# Altium project OMODRI.PrjPcb (part 5 of 5)

## Sheet OMODRI_Support.SchDoc
size A3; Date: Not shown in title block; ApprovedBy: Not shown in title block; CheckedBy: Not shown in title block; Author: Not shown in title block; CompanyName: Not shown in title block; DrawnBy: Cody Watkins; Engineer: Not shown in title block; Organization: Not shown in title block; Address1: Not shown in title block; Address2: Not shown in title block; Address3: Not shown in title block; Address4: Not shown in title block; DocumentNumber: 3; Revision: Use project parameter SCH_Rev; SheetNumber: 3; SheetTotal: 11; PageSetup: Record=PageOptions|CenterHorizontal=True|CenterVertical=True|PrintScale=1.00|XCorrection=1.00|YCorrection=1.00|PrintKind=0|BorderSize=5000000|LeftOffset=0|BottomOffset=0|Orientation=2|PaperLength=1000|PaperWidth=1000|Scale=100|PaperSource=15|PrintQuality=600|MediaType=1|DitherType=10|PaperKind=Letter|PrintScaleMode=1; CurrentTime: Not shown in title block; CurrentDate: Not shown in title block; Time: Not shown in title block; DocumentFullPathAndName: Not shown in title block; DocumentName: Not shown in title block; ModifiedDate: Not shown in title block; ImagePath: Not shown in title block
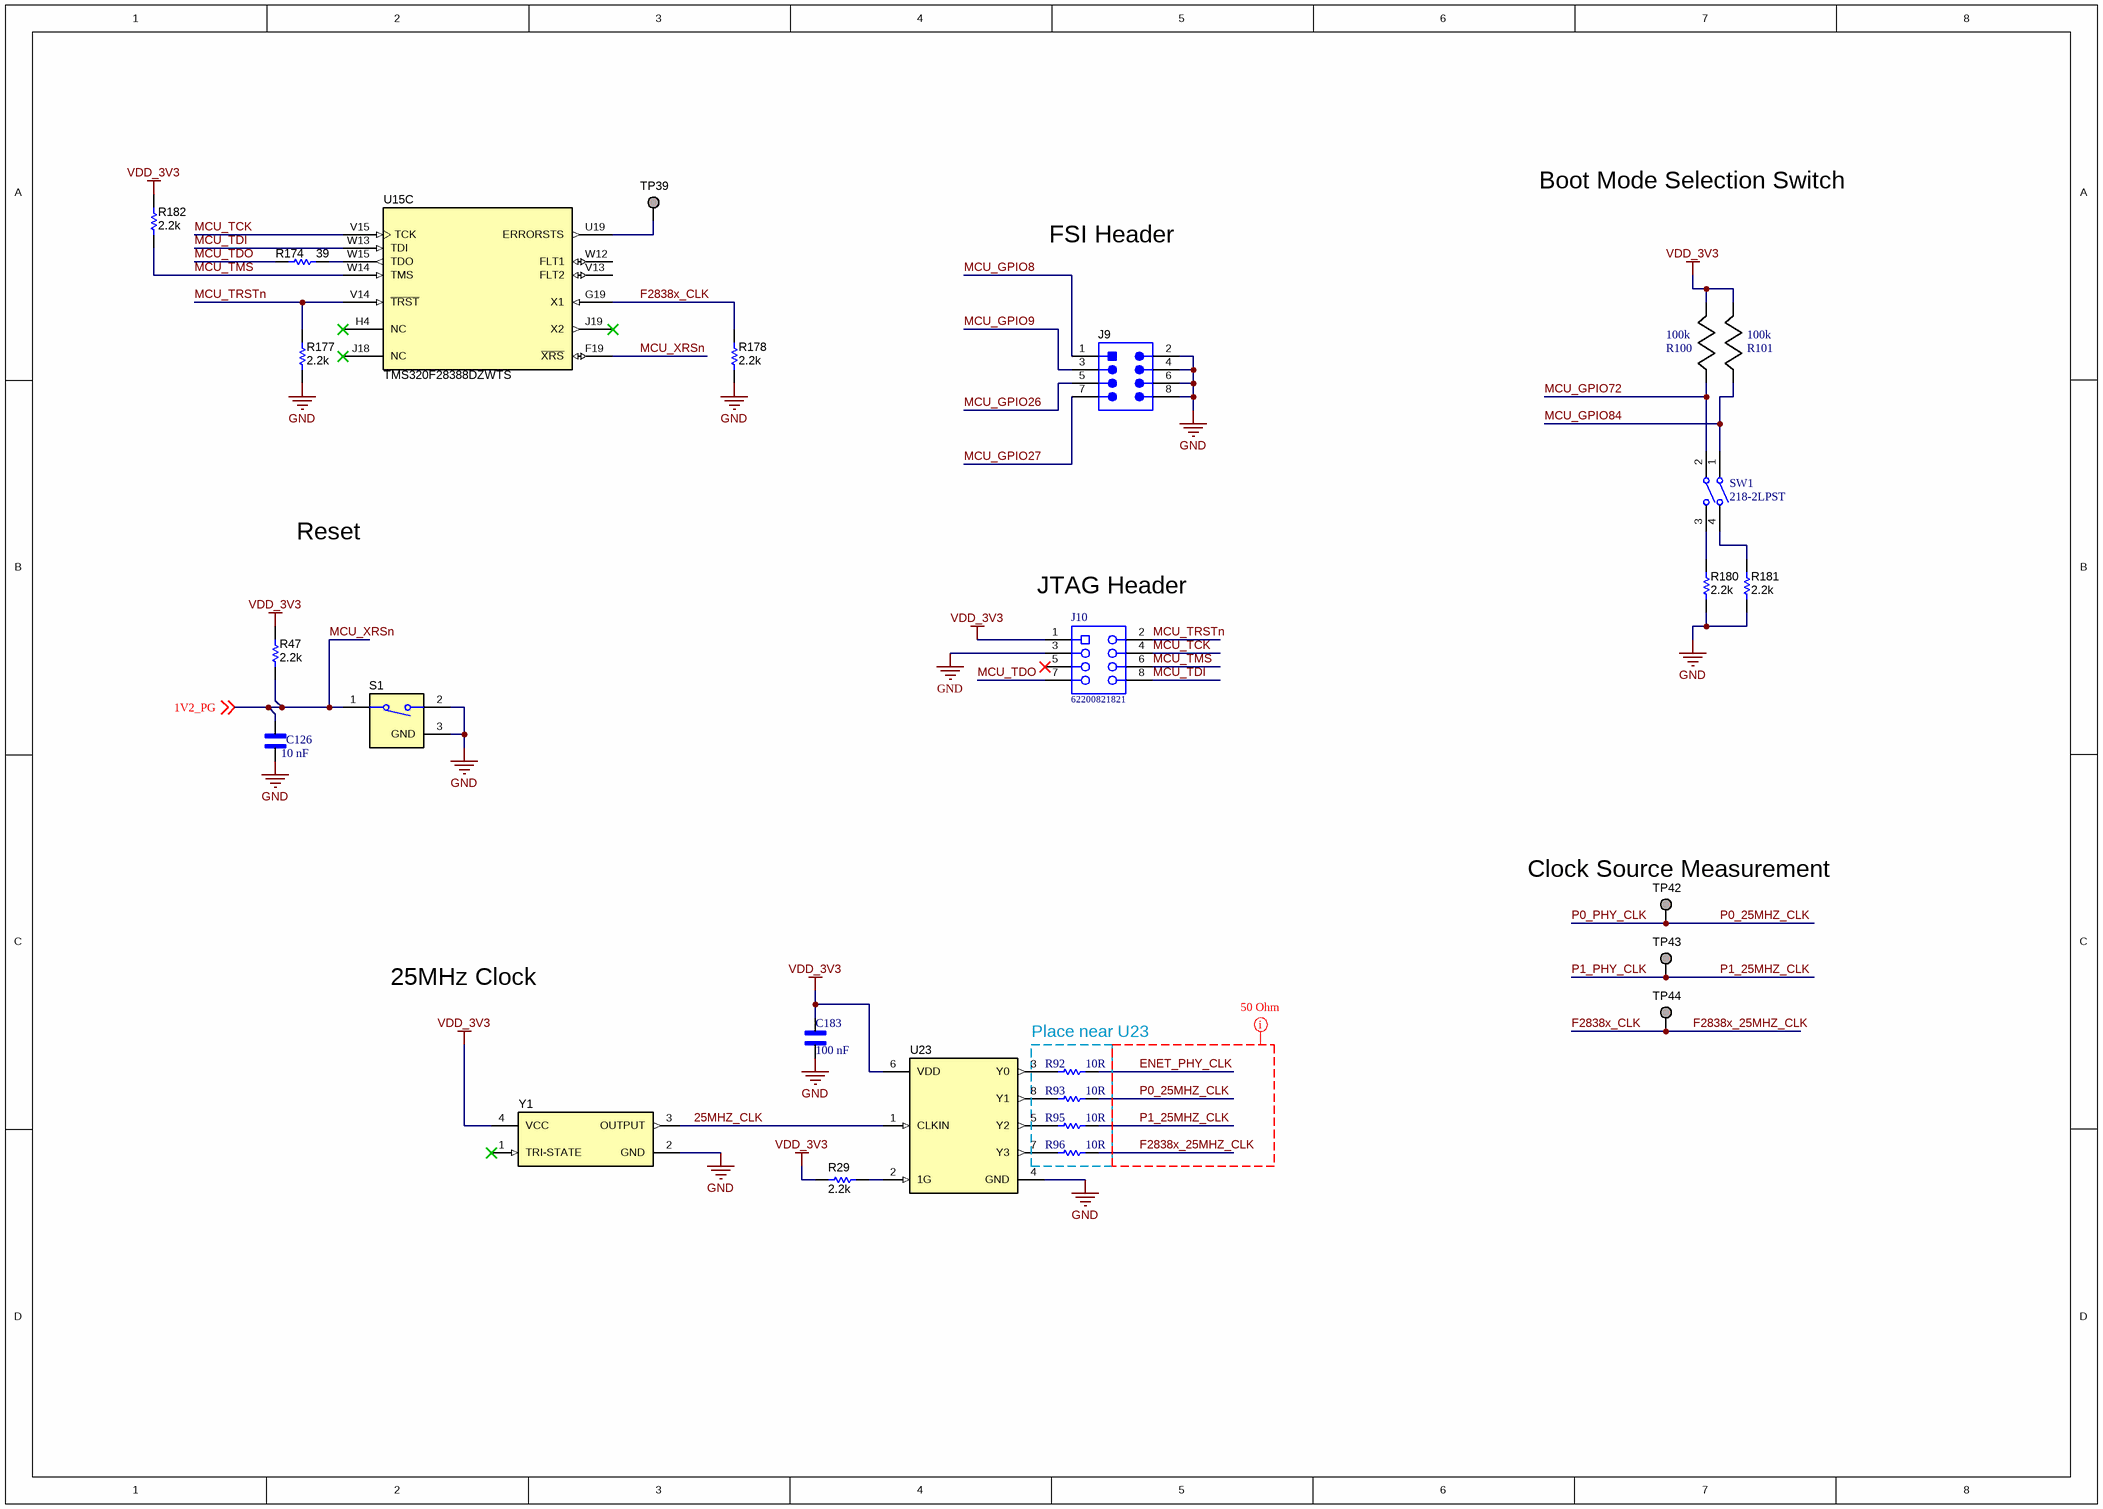
[diagram p8: OMODRI_Support.SchDoc]

### Parts
C126  value 10 nF  [CAPC0603X33N]  (hidden comment: GRM033R71E103KE14D)
C183  value 100 nF  [CAPC0603X33N]  (hidden comment: GRM033R61E104KE14D)
J9  TMM-104-01-T-D  [Samtec_TMM-104-01-x-D]  (value not drawn)
J10  62200821821  [62200821821]
R29  ValueDisplayed: 2.2k  [0402]  (hidden comment: CRCW04022K20JNED)
R47  ValueDisplayed: 2.2k  [0402]  (hidden comment: CRCW04022K20JNED)
R92  Resistance: 10R  [RESC1005X40X25ML05T10]  (hidden comment: CRCW040210R0FKEDHP)
R93  Resistance: 10R  [RESC1005X40X25ML05T10]  (hidden comment: CRCW040210R0FKEDHP)
R95  Resistance: 10R  [RESC1005X40X25ML05T10]  (hidden comment: CRCW040210R0FKEDHP)
R96  Resistance: 10R  [RESC1005X40X25ML05T10]  (hidden comment: CRCW040210R0FKEDHP)
R100  Resistance: 100k  [0402]  (hidden comment: CRCW0402100KFKED)
R101  Resistance: 100k  [0402]  (hidden comment: CRCW0402100KFKED)
R174  ValueDisplayed: 39  [0402]  (hidden comment: CRCW040239R0JNED)
R177  ValueDisplayed: 2.2k  [0402]  (hidden comment: CRCW04022K20JNED)
R178  ValueDisplayed: 2.2k  [0402]  (hidden comment: CRCW04022K20JNED)
R180  ValueDisplayed: 2.2k  [0402]  (hidden comment: CRCW04022K20JNED)
R181  ValueDisplayed: 2.2k  [0402]  (hidden comment: CRCW04022K20JNED)
R182  ValueDisplayed: 2.2k  [0402]  (hidden comment: CRCW04022K20JNED)
S1  B3U-1100P  [SW_B3U-1100P]  (value not drawn)
SW1  218-2LPST  [CTS-218-2LPST_V]
TP39  TESTPOINT  [TP_50MIL-25MILHOLE]  (value not drawn)  (no BOM)
TP42  TESTPOINT  [TP_50MIL-25MILHOLE]  (value not drawn)  (no BOM)
TP43  TESTPOINT  [TP_50MIL-25MILHOLE]  (value not drawn)  (no BOM)
TP44  TESTPOINT  [TP_50MIL-25MILHOLE]  (value not drawn)  (no BOM)
U15  TMS320F28388DZWTS  [ZWT0337A]  (part C of 5)
U23  CDCLVC1104PW  [PW0008A_N]  (value not drawn)
Y1  ECS-2520S33-250-FN-TR  [ECS_ECS-2520S]  (value not drawn)

### Nets
GND: C126.1 C183.2 J9.2 J9.4 J9.6 J9.8 J10.3 R177.1 R178.1 R180.2 R181.1 S1.2 S1.3(GND) U23.4(GND) Y1.2(GND)
VDD_3V3: C183.1 J10.1 R29.2 R47.2 R100.1 R101.1 R182.2 U23.6(VDD) Y1.4(VCC)
25MHZ_CLK: U23.1(CLKIN) Y1.3(OUTPUT)
ENET_PHY_CLK: R92.2
F2838x_25MHZ_CLK: R96.2 R178.2 TP44.1 U15.G19(X1)  [also labelled F2838x_CLK]
MCU_GPIO8: J9.1
MCU_GPIO9: J9.3
MCU_GPIO26: J9.5
MCU_GPIO27: J9.7
MCU_GPIO72: R100.2 SW1.2
MCU_GPIO84: R101.2 SW1.1
MCU_TCK: J10.4 U15.V15(TCK)
MCU_TDI: J10.8 U15.W13(TDI)
MCU_TDO: J10.7 R174.1
MCU_TMS: J10.6 R182.1 U15.W14(TMS)
MCU_TRSTn: J10.2 R177.2 U15.V14(~{TRST})
MCU_XRSn: C126.2 R47.1 S1.1 U15.F19(~{XRS}) ; off-sheet 1V2_PG  [also labelled 1V2_PG]
P0_25MHZ_CLK: R93.2 TP42.1  [also labelled P0_PHY_CLK]
P1_25MHZ_CLK: R95.2 TP43.1  [also labelled P1_PHY_CLK]
NetR29_1: R29.1 U23.2(1G)
NetR92_1: R92.1 U23.3(Y0)
NetR93_1: R93.1 U23.8(Y1)
NetR95_1: R95.1 U23.5(Y2)
NetR96_1: R96.1 U23.7(Y3)
NetR174_2: R174.2 U15.W15(TDO)
NetR180_1: R180.1 SW1.3
NetR181_2: R181.2 SW1.4
NetTP39_1: TP39.1 U15.U19(ERRORSTS)

Not connected (* = marked no-connect by the designer): J10 5*; U15 H4(NC)* J18(NC)* J19(X2)* V13(FLT2) W12(FLT1); Y1 1(TRI-STATE)*

### Layout directives
50 Ohm Impedance: Undefined: ENET_PHY_CLK, F2838x_25MHZ_CLK, P0_25MHZ_CLK, P1_25MHZ_CLK

### Notes on the sheet
- Boot Mode Selection Switch
- FSI Header
- Reset
- (near J10) JTAG Header
- (near TP42) Clock Source Measurement
- 25MHz Clock
- Place near U23
- Drawn By:
- SVN Rev:
- Number:
- TID #:
- Orderable:
- Rev:
- Sheet Title:
- File:
- Project Title:
- Designed for:
- Assembly Variant:
- Mod. Date:
- Sheet:
- Size:
- of
- B
- http://www.ti.com
- Texas Instruments and/or its licensors do not warrant the accuracy or completeness of this specification or any information contained therein. Texas Instruments and/or its licensors do not warrant that this design will meet the specifications, will be suitable for your application or fit for any particular purpose, or will operate in an implementation. Texas Instruments and/or its licensors do not warrant that the design is production worthy. You should completely validate and test your design implementation to confirm the system functionality for your application.
- Engineer:
- Contact:
- © Texas Instruments

### Library data of the parts
C126 = GRM033R71E103KE14D: SMD Capacitor X7R_EIA_ with Capacitance: 10000pF Tol. 10%. Rated Voltage: 25Vdc; MF: Murata; SnapEDA_Link: https://www.snapeda.com/parts/GRM033R71E103KE14D/Murata/view-part/4379447/?ref=snap; Package: 0603 Taiyo Yuden; MP: GRM033R71E103KE14D; Digi-Key_Purchase_URL: https://www.digikey.com/product-detail/en/murata-electronics/GRM033R71E103KE14D/490-14454-1-ND/6606915?utm_source=snapeda&utm_medium=aggregator&utm_campaign=symbol; Digi-Key_Part_Number: 490-14454-1-ND
C183 = GRM033R61E104KE14D: as C114-C116 on sheet OMODRI_EtherCAT_1; SnapEDA_Link: https://www.snapeda.com/parts/GRM033R61E104KE14D/Murata/view-part/4375622/?ref=snap; Availability: Unavailable; MP: GRM033R61E104KE14D; Package: 0603 Taiyo Yuden; Price: None
J9 = CMP-0055568-2: Header, 2mm, 4x2, Tin, TH; Manufacturer: Samtec; Current_A: 3.2A; Shrouded: N; Gender: Male; Cert_CSA: Y; Row_Count: 2; ComponentLink1URL: http://suddendocs.samtec.com/catalog_english/tmm_th.pdf; ClassName: Header; Supplier Part Number 2: 12P0661; Supplier 2: Newark; Supplier Part Number 3: 1803386; Color: Black; Supplier 3: Farnell; RoHS: Y; MountType: TH; Supplier 1: Digi-Key; PackageReference: Header, 2mm, 4x2, TH; PinCount: 8; CompType: Header; PartNumber: TMM-104-01-T-D; Orientation: Vertical; RowSpacing_mm: 2; ComponentLink1Description: Datasheet URL; Supplier Part Number 1: SAM1177-04-ND; Pitch_mm: 2; ContactFinish: Tin; Cert_UL: Y
J10 = CMP-1502-01180-1: THT Vertical Socket Header WR-PHD, Pitch 1.27 mm, Dual Row, 8 pins; Manufacturer: Wurth Elektronik; Withstanding Voltage: 500VAC; Working Voltage: 250VAC; Contact Resistance: 20mOhm; Gender: Female; Pitch: 1.27mm; Rated Current: 1A; Pin Number: 8; Part Number: 62200821821; Row Number: Dual; Package Reference: 62200821821; Mounting Technology: THT; Packaging: Tube; Manufacturer URL: http://www.we-online.de; Publisher: WurthElektronik; Orientation: Vertical; Operating Temperature: -40to105degC; Datasheet URL: https://katalog.we-online.de/em/datasheet/62200821821.pdf
R29 R47 R177 R178 R182 = CMP-0026890-5: as R4-R6 on sheet OMODRI_EtherCAT_1; Supplier Part Number 2: 59M6710; Supplier 2: Newark; Supplier Part Number 3: 71-CRCW0402J-2.2K-E3; Supplier 3: Mouser; RoHS: E; Value1: 5%; MountType: SMT; Supplier 1: Digi-Key; PackageReference: 0402; Tolerance_%: 5%; Res_ohm: 2.2k; SizeArea_mm2: 0.5; CompType: Resistor; PartNumber: CRCW04022K20JNED; ComponentLink1Description: Datasheet link; Supplier Part Number 1: 541-2.2KJCT-ND; Technology: Thick Film; ComponentLink1URL: http://www.vishay.com/docs/20035/dcrcwe3.pdf
R92 R93 R95 R96 = CRCW040210R0FKEDHP: SMD Chip Resistor, 0402 [1005 Metric], 10 ohm, CRCW-HP e3 Series, 50 V, Thick Film, 200 mW; Manufacturer: Vishay Dale; Voltage Rating (DC): 50V; Temperature Coefficient: 100ppm/°C; Tolerance: 1%; Power Rating: 125mW; Part Number: CRCW040210R0FKEDHP; Supplier 1: Digi-Key; Manufacturer Part Number: CRCW040210R0FKEDHP; RoHS: Yes; Category: Chip SMD Resistors; Stock 1: 25822; Pricing 1: 1=0,14000, 10=0,12600, 100=0,04840, 1000=0,02130, 2500=0,01839, 5000=0,01646 (USD); Mount: Surface Mount; Case/Package: 0402; Weight: 2.3E-05oz; Contact Plating: Tin; Case Code (Imperial): 0402; Case Code (Metric): 1005; Min Operating Temperature: -55°C; Max Operating Temperature: 155°C; Packaging: Tape and Reel; Voltage Rating: 50V; Package Quantity: 10000; Termination: SMD/SMT; Composition: Thick Film; Military Standard: Not; Length: 1mm; Height: 0.3mm; Width: 0.5mm; Depth: 0.5mm; Radiation Hardening: No; Lead Free: Lead Free; REACH SVHC: Unknown; ComponentLink1URL: https://datasheet.ciiva.com/5542/crcwhpe3-46056-5542142.pdf?src-supplier=Mouser; ComponentLink1Description: https://datasheet.ciiva.com/5542/crcwhpe3-46056-5542142.pdf?src-supplier=Mouser; Supplier Part Number 1: 541-10.0YCT-ND
R100 R101 = CRCW0402100KFKED: Res Thick Film 0402 100K Ohm 1% 1/16W 100ppm/C Molded SMD Paper T/R; Manufacturer: Vishay; Vendor: Vishay-Dale; Temperature Coefficient: 100ppm/°C; Power Rating: 63mW; Voltage Rating: 50V; Manufacturer_Part_Number: CRCW0402100KFKED; Manufacturer_Name: Vishay-Dale; RefDes: RefDes; TYPE: TYPE; Value: Value; Supplier 1: Farnell; Manufacturer Part Number: CRCW0402100KFKED; RoHS: Yes; Category: Chip SMD Resistors; Stock 1: 6820000; Pricing 1: 10000=0,00330 (EUR); Mount: Surface Mount; Case/Package: 0402; Number of Pins: 2; Weight: 2.3E-05oz; Contact Plating: Tin; Case Code (Metric): 1005; Case Code (Imperial): 0402; Min Operating Temperature: -55°C; Max Operating Temperature: 155°C; Tolerance: 1%; Composition: Thick Film; Termination: SMD/SMT; Number of Terminations: 2; Features: Automotive AEC-Q200; Max Power Dissipation: 63mW; Packaging: Tape and Reel; Package Quantity: 10000; Voltage Rating (DC): 50V; Military Standard: Not; Length: 1mm; Height: 0.35mm; Depth: 0.5mm; Width: 0.02inch; Radiation Hardening: No; Lead Free: Lead Free; REACH SVHC: Unknown; ComponentLink1URL: https://datasheet.ciiva.com/11810/0900766b80d98824-11810752.pdf?src-supplier=RSComponents; ComponentLink1Description: https://datasheet.ciiva.com/11810/0900766b80d98824-11810752.pdf?src-supplier=RSComponents; ComponentLink2URL: https://datasheet.ciiva.com/2463/dcrcwe3-2463064.pdf?src-supplier=Digi-Key; ComponentLink2Description: https://datasheet.ciiva.com/2463/dcrcwe3-2463064.pdf?src-supplier=Digi-Key; ComponentLink3URL: https://datasheet.ciiva.com/2463/dcrcwe3-2463065.pdf?src-supplier=Digi-Key; ComponentLink3Description: https://datasheet.ciiva.com/2463/dcrcwe3-2463065.pdf?src-supplier=Digi-Key; ComponentLink4URL: https://datasheet.ciiva.com/2463/dcrcwe3-2463066.pdf?src-supplier=Digi-Key; ComponentLink4Description: https://datasheet.ciiva.com/2463/dcrcwe3-2463066.pdf?src-supplier=Digi-Key; ComponentLink5URL: https://datasheet.ciiva.com/3255/dcrcwe3-3255948.pdf?src-supplier=Avnet; ComponentLink5Description: https://datasheet.ciiva.com/3255/dcrcwe3-3255948.pdf?src-supplier=Avnet; ComponentLink6URL: https://datasheet.ciiva.com/5546/dcrcwe3-109170-5546638.pdf?src-supplier=Mouser; ComponentLink6Description: https://datasheet.ciiva.com/5546/dcrcwe3-109170-5546638.pdf?src-supplier=Mouser; ComponentLink7URL: https://datasheet.ciiva.com/26316/fld-crcw-e3-data-en-26316630.pdf?src-supplier=Distrelec; ComponentLink7Description: https://datasheet.ciiva.com/26316/fld-crcw-e3-data-en-26316630.pdf?src-supplier=Distrelec; ComponentLink8URL: https://datasheet.ciiva.com/16776/70201119-16776281.pdf?src-supplier=Allied+Electronics; ComponentLink8Description: https://datasheet.ciiva.com/16776/70201119-16776281.pdf?src-supplier=Allied+Electronics; ComponentLink9URL: https://datasheet.ciiva.com/16941/dcrcwe3-16941129.pdf?src-supplier=Avnet+Europe; ComponentLink9Description: https://datasheet.ciiva.com/16941/dcrcwe3-16941129.pdf?src-supplier=Avnet+Europe; ComponentLink10URL: https://datasheet.ciiva.com/3255/dcrcwe3-3255947.pdf?src-supplier=Avnet; ComponentLink10Description: https://datasheet.ciiva.com/3255/dcrcwe3-3255947.pdf?src-supplier=Avnet; ComponentLink11URL: https://datasheet.ciiva.com/16208/dcrcwe3-16208508.pdf?src-supplier=Future+Electronics; ComponentLink11Description: https://datasheet.ciiva.com/16208/dcrcwe3-16208508.pdf?src-supplier=Future+Electronics; ComponentLink12URL: https://datasheet.ciiva.com/46441/1720486-46441598.pdf?src-supplier=Element14; ComponentLink12Description: https://datasheet.ciiva.com/46441/1720486-46441598.pdf?src-supplier=Element14; Supplier Part Number 1: 2121857
R174 = CMP-0026916-3: RES, 39, 5%, 0.063 W, AEC-Q200 Grade 0, 0402; Manufacturer: Vishay-Dale; Power_W: 63mW; TempCo: 200 ppm/C; Value_Code: 39R0; Value: 39; EIA_Code: E24; SizeX_mm: 1; SizeY_mm: 0.5; SizeZ_mm: 0.6; Value2: 0.063W; AEC Qualified: Y; VDC_V: 50V; AEC Category: Q200; AEC Grade: 0; Supplier Part Number 2: 89M6649; Supplier 2: Newark; Supplier Part Number 3: 71-CRCW0402J-39-E3; Supplier 3: Mouser; RoHS: E; Value1: 5%; MountType: SMT; Supplier 1: Digi-Key; PackageReference: 0402; Tolerance_%: 5%; Res_ohm: 39; SizeArea_mm2: 0.5; CompType: Resistor; PartNumber: CRCW040239R0JNED; ComponentLink1Description: Datasheet link; Supplier Part Number 1: 541-39JCT-ND; Technology: Thick Film; ComponentLink1URL: http://www.vishay.com/docs/20035/dcrcwe3.pdf
R180 R181 = CMP-0026890-5: RES, 2.2 k, 5%, 0.063 W, AEC-Q200 Grade 0, 0402; Manufacturer: Vishay-Dale; Value: 2.2k; Value_Code: 2k20; Power_W: 63mW; Value2: 0.063W; VDC_V: 50V; TempCo: 200 ppm/C; EIA_Code: E24; AEC Category: Q200; AEC Qualified: Y; AEC Grade: 0; SizeArea_mm2: 0.5; SizeX_mm: 1; SizeZ_mm: 0.6; CompType: Resistor; PartNumber: CRCW04022K20JNED; PackageReference: 0402; RoHS: E; Res_ohm: 2.2k; Tolerance_%: 5%; Value1: 5%; MountType: SMT; Technology: Thick Film; ComponentLink1Description: Datasheet link; ComponentLink1URL: http://www.vishay.com/docs/20035/dcrcwe3.pdf; Supplier 1: Digi-Key; Supplier Part Number 1: 541-2.2KJCT-ND; Supplier 2: Newark; Supplier Part Number 2: 59M6710; Supplier 3: Mouser; Supplier Part Number 3: 71-CRCW0402J-2.2K-E3; SizeY_mm: 0.5
S1 = CMP-0002193-2: Switch, SPST-NO, Off-Mom, 12 V, SMD; Manufacturer: Omron Electronic Components; CurrentRating_mA: 50A; PositionCount: 1; VDC_V: 12V; Supplier 2: Newark; Supplier 3: Mouser; Supplier 1: Digi-Key; Supplier Part Number 1: SW1021CT-ND; Supplier Part Number 2: 39M4619; Supplier Part Number 3: 653-B3U-1100P; PartNumber: B3U-1100P; ComponentLink1Description: Datasheet URL; LatestRevisionDate: 2017-03-09; CompType: Switch; Publisher: Texas Instruments; Circuit: SPST-NO; RoHS: Y; Orientation: Top Actuated; SwitchFunction: Off-Mom; PackageReference: SMD, 3-Leads, Body 3x2.5mm; MountType: SMT; ComponentLink1URL: http://www.omron.com/ecb/products/pdf/en-b3u.pdf
SW1 = CMP-2000-05530-1: Half Pitch DIP Switch Auto Placeable, 25 mA, 24 V, -55 to 85 degC, 4-Pin SMD, RoHS, Tube; Manufacturer: CTS Corporation; Voltage Rating: 24VDC; Number of Positions: 2; Online Catalog: 218Series; Actuator Type: Slide(Standard); Washable: Yes; Pitch: 0.050"(1.27mm),Half; 3D Model: 218Series2Pole.stp; Catalog Drawings: 218-2218SeriesFootprint218SeriesEnd; Other Names: 2182LPSTCT2182LPST; Electrical Life: 1,000Cycles; Current Rating: 25mA; Actuator Level: Flush,Recessed; Circuit: SPST; Package Reference: 218-2LPST; Contact Finish: Gold; Product Training Modules: DIPSwitch; Mounting Technology: SurfaceMount; Datasheet URL: http://www.ctscorp.com/wp-content/uploads/2015/11/218.pdf; Height Above Board: 0.104"(2.65mm); Operating Temperature: -55°C~85°C; Family: DIPSwitches; Package Description: 4-Pin Surface Mount Device, Body 5.8 x 3.71 mm, Pitch 1.27 mm; Packaging: Tube; Category: Switches; Features: EpoxySealedTerminals,TapeSeal; Series: 218; Mounting Type: SurfaceMount; Mechanical Life: -; Termination Style: GullWing; Length: 0.146"(3.71mm); Body Material: -; Standard Package: 145; Contact Material: BerylliumCopper; Manufacturer URL: http://www.ctscorp.com/; Datasheet Version: 12/2008
TP39 TP42-TP44 = CMP-0078143-2: TEST POINT.  No entry in BOM.; CompType: Testpoint; PackageReference: N/A; Manufacturer: N/A; PartNumber: N/A; Library Reference: TESTPOINT
U15 = CMP-0081777-3: TMS320F28388DZWTS, ZWT0337A (NFBGA-337); Manufacturer: Texas Instruments; SizeAreaWB_mm2: 324; SizeArea_mm2: 256; AEC Qualified: N; AEC Category: Q200; SizeZ_mm: 1.4; SizeY_mm: 16; CompType: IC; ComponentLink1Description: Datasheet Link; ComponentLink2Description: Product Folder; PackageReference: ZWT0337A; PartNumber: TMS320F28388DZWTS; PackageDescription: NFBGA-337; ComponentLink2URL: http://www.ti.com/product/tms320f28388d; Alternate Manufacturer: Texas Instruments; ComponentLink3URL: http://www.ti.com/product/tms320f28388d/datasheet; ComponentLink1URL: http://www.ti.com/lit/ds/symlink/tms320f28388d.pdf; MountType: SMT; ComponentLink3Description: Online Datasheet; SizeX_mm: 16
U23 = CMP-0065661-1: Low Jitter, 1:4 LVCMOS Fan-out Clock Buffer, PW0008A (TSSOP-8); Alternate Manufacturer: Texas Instruments; Green_Lifecycle: Active; SizeAreaWB_mm2: 42.0; Green_REACh: Passed; U/M: EA; SizeZ_mm: 1.2; SizeX_mm: 6.4; SizeY_mm: 3.0; SizeArea_mm2: 19.2; CompType: IC; ComponentLink1URL: http://www.ti.com/lit/ds/symlink/cdclvc1104.pdf; Publisher: Texas Instruments; PackageDescription: TSSOP-8; RoHS: Y; Footprint Path 6: C:\AltiumLibraries\Footprints\TI\.PcbLib; MountType: SMT; Green_EU RoHS-2: Passed; Manufacturer: Texas Instruments; Green_EU RoHS: Passed; PackageReference: PW0008A; LatestRevisionDate: 2017-06-09; PartNumber: CDCLVC1104PW; ComponentLink1Description: Datasheet Link
Y1 = CMP-0082061-1: Oscillator, 25 MHz, 15 pF, SMD; Manufacturer: ECS Inc.; Frequency Stability: 10 ppm; SizeAreaWB_mm2: 10.5; SizeArea_mm2: 5; AEC Qualified: N; AEC Category: Q200; TaMax_C: 85°C; SizeZ_mm: 1; Frequency_Fixed: 25MHz; TaMin_C: -40°C; SizeY_mm: 2.5; Load Capacitance: 15 pF; SizeX_mm: 2; ComponentLink1Description: Datasheet Link; RoHS: Y; Supplier 1: Digi-Key; PackageReference: 2x2.5mm; PartNumber: ECS-2520S33-250-FN-TR; Supplier Part Number 2: 520-2520S33-250-FNT; Supplier 2: Mouser; AEC Grade: N/A; ComponentLink1URL: https://www.ecsxtal.com/store/pdf/ECS-2520S.pdf; CompType: Oscillator; Supplier Part Number 1: XC2198CT-ND; MountType: SMT

## Sheet OMODRI_GPIO.SchDoc
size A3; Date: Not shown in title block; ApprovedBy: Not shown in title block; CheckedBy: Not shown in title block; Author: Not shown in title block; CompanyName: Not shown in title block; DrawnBy: Cody Watkins; Engineer: Not shown in title block; Organization: Not shown in title block; Address1: Not shown in title block; Address2: Not shown in title block; Address3: Not shown in title block; Address4: Not shown in title block; DocumentNumber: 2; Revision: Use project parameter SCH_Rev; SheetNumber: 2; SheetTotal: 11; PageSetup: Record=PageOptions|CenterHorizontal=True|CenterVertical=True|PrintScale=1.00|XCorrection=1.00|YCorrection=1.00|PrintKind=0|BorderSize=5000000|LeftOffset=0|BottomOffset=0|Orientation=2|PaperLength=1000|PaperWidth=1000|Scale=100|PaperSource=15|PrintQuality=600|MediaType=1|DitherType=10|PaperKind=Letter|PrintScaleMode=1; CurrentTime: Not shown in title block; CurrentDate: Not shown in title block; Time: Not shown in title block; DocumentFullPathAndName: Not shown in title block; DocumentName: Not shown in title block; ModifiedDate: Not shown in title block; ImagePath: Not shown in title block
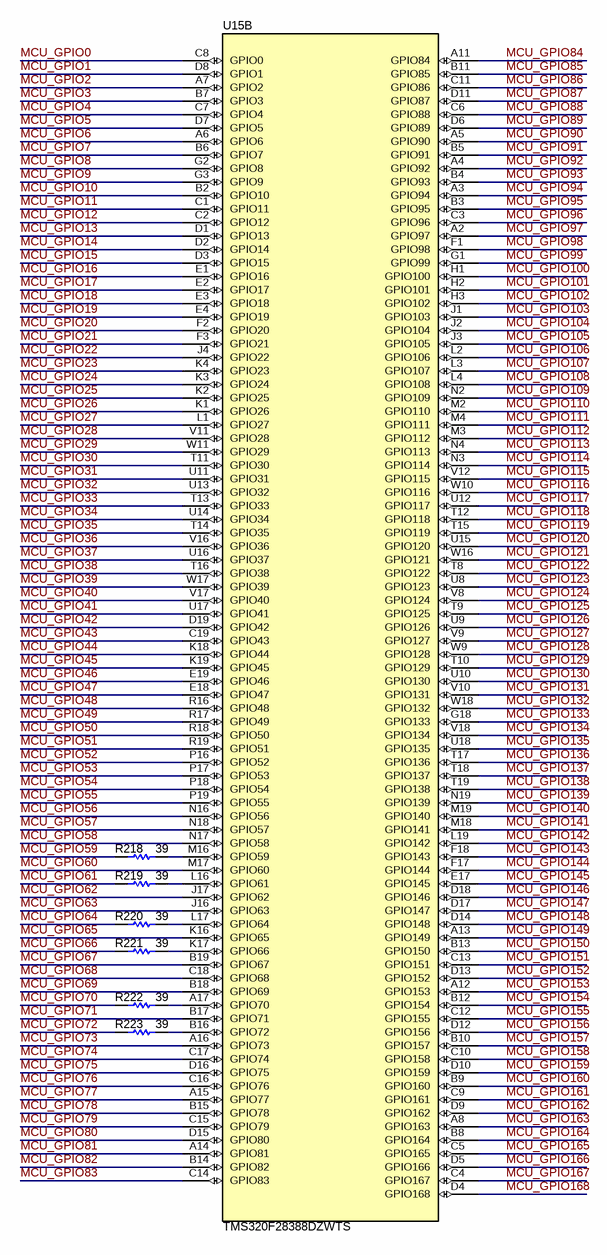
[diagram p9: OMODRI_GPIO.SchDoc]

### Parts
R218  ValueDisplayed: 39  [0402]  (hidden comment: CRCW040239R0JNED)
R219  ValueDisplayed: 39  [0402]  (hidden comment: CRCW040239R0JNED)
R220  ValueDisplayed: 39  [0402]  (hidden comment: CRCW040239R0JNED)
R221  ValueDisplayed: 39  [0402]  (hidden comment: CRCW040239R0JNED)
R222  ValueDisplayed: 39  [0402]  (hidden comment: CRCW040239R0JNED)
R223  ValueDisplayed: 39  [0402]  (hidden comment: CRCW040239R0JNED)
U15  TMS320F28388DZWTS  [ZWT0337A]  (part B of 5)

### Nets
MCU_GPIO0: U15.C8(GPIO0)
MCU_GPIO1: U15.D8(GPIO1)
MCU_GPIO2: U15.A7(GPIO2)
MCU_GPIO3: U15.B7(GPIO3)
MCU_GPIO4: U15.C7(GPIO4)
MCU_GPIO5: U15.D7(GPIO5)
MCU_GPIO6: U15.A6(GPIO6)
MCU_GPIO7: U15.B6(GPIO7)
MCU_GPIO8: U15.G2(GPIO8)
MCU_GPIO9: U15.G3(GPIO9)
MCU_GPIO10: U15.B2(GPIO10)
MCU_GPIO11: U15.C1(GPIO11)
MCU_GPIO12: U15.C2(GPIO12)
MCU_GPIO13: U15.D1(GPIO13)
MCU_GPIO14: U15.D2(GPIO14)
MCU_GPIO15: U15.D3(GPIO15)
MCU_GPIO16: U15.E1(GPIO16)
MCU_GPIO17: U15.E2(GPIO17)
MCU_GPIO18: U15.E3(GPIO18)
MCU_GPIO19: U15.E4(GPIO19)
MCU_GPIO20: U15.F2(GPIO20)
MCU_GPIO21: U15.F3(GPIO21)
MCU_GPIO22: U15.J4(GPIO22)
MCU_GPIO23: U15.K4(GPIO23)
MCU_GPIO24: U15.K3(GPIO24)
MCU_GPIO25: U15.K2(GPIO25)
MCU_GPIO26: U15.K1(GPIO26)
MCU_GPIO27: U15.L1(GPIO27)
MCU_GPIO28: U15.V11(GPIO28)
MCU_GPIO29: U15.W11(GPIO29)
MCU_GPIO30: U15.T11(GPIO30)
MCU_GPIO31: U15.U11(GPIO31)
MCU_GPIO32: U15.U13(GPIO32)
MCU_GPIO33: U15.T13(GPIO33)
MCU_GPIO34: U15.U14(GPIO34)
MCU_GPIO35: U15.T14(GPIO35)
MCU_GPIO36: U15.V16(GPIO36)
MCU_GPIO37: U15.U16(GPIO37)
MCU_GPIO38: U15.T16(GPIO38)
MCU_GPIO39: U15.W17(GPIO39)
MCU_GPIO40: U15.V17(GPIO40)
MCU_GPIO41: U15.U17(GPIO41)
MCU_GPIO42: U15.D19(GPIO42)
MCU_GPIO43: U15.C19(GPIO43)
MCU_GPIO44: U15.K18(GPIO44)
MCU_GPIO45: U15.K19(GPIO45)
MCU_GPIO46: U15.E19(GPIO46)
MCU_GPIO47: U15.E18(GPIO47)
MCU_GPIO48: U15.R16(GPIO48)
MCU_GPIO49: U15.R17(GPIO49)
MCU_GPIO50: U15.R18(GPIO50)
MCU_GPIO51: U15.R19(GPIO51)
MCU_GPIO52: U15.P16(GPIO52)
MCU_GPIO53: U15.P17(GPIO53)
MCU_GPIO54: U15.P18(GPIO54)
MCU_GPIO55: U15.P19(GPIO55)
MCU_GPIO56: U15.N16(GPIO56)
MCU_GPIO57: U15.N18(GPIO57)
MCU_GPIO58: U15.N17(GPIO58)
MCU_GPIO59: R218.1
MCU_GPIO60: U15.M17(GPIO60)
MCU_GPIO61: R219.1
MCU_GPIO62: U15.J17(GPIO62)
MCU_GPIO63: U15.J16(GPIO63)
MCU_GPIO64: R220.1
MCU_GPIO65: U15.K16(GPIO65)
MCU_GPIO66: R221.1
MCU_GPIO67: U15.B19(GPIO67)
MCU_GPIO68: U15.C18(GPIO68)
MCU_GPIO69: U15.B18(GPIO69)
MCU_GPIO70: R222.1
MCU_GPIO71: U15.B17(GPIO71)
MCU_GPIO72: R223.1
MCU_GPIO73: U15.A16(GPIO73)
MCU_GPIO74: U15.C17(GPIO74)
MCU_GPIO75: U15.D16(GPIO75)
MCU_GPIO76: U15.C16(GPIO76)
MCU_GPIO77: U15.A15(GPIO77)
MCU_GPIO78: U15.B15(GPIO78)
MCU_GPIO79: U15.C15(GPIO79)
MCU_GPIO80: U15.D15(GPIO80)
MCU_GPIO81: U15.A14(GPIO81)
MCU_GPIO82: U15.B14(GPIO82)
MCU_GPIO83: U15.C14(GPIO83)
MCU_GPIO84: U15.A11(GPIO84)
MCU_GPIO85: U15.B11(GPIO85)
MCU_GPIO86: U15.C11(GPIO86)
MCU_GPIO87: U15.D11(GPIO87)
MCU_GPIO88: U15.C6(GPIO88)
MCU_GPIO89: U15.D6(GPIO89)
MCU_GPIO90: U15.A5(GPIO90)
MCU_GPIO91: U15.B5(GPIO91)
MCU_GPIO92: U15.A4(GPIO92)
MCU_GPIO93: U15.B4(GPIO93)
MCU_GPIO94: U15.A3(GPIO94)
MCU_GPIO95: U15.B3(GPIO95)
MCU_GPIO96: U15.C3(GPIO96)
MCU_GPIO97: U15.A2(GPIO97)
MCU_GPIO98: U15.F1(GPIO98)
MCU_GPIO99: U15.G1(GPIO99)
MCU_GPIO100: U15.H1(GPIO100)
MCU_GPIO101: U15.H2(GPIO101)
MCU_GPIO102: U15.H3(GPIO102)
MCU_GPIO103: U15.J1(GPIO103)
MCU_GPIO104: U15.J2(GPIO104)
MCU_GPIO105: U15.J3(GPIO105)
MCU_GPIO106: U15.L2(GPIO106)
MCU_GPIO107: U15.L3(GPIO107)
MCU_GPIO108: U15.L4(GPIO108)
MCU_GPIO109: U15.N2(GPIO109)
MCU_GPIO110: U15.M2(GPIO110)
MCU_GPIO111: U15.M4(GPIO111)
MCU_GPIO112: U15.M3(GPIO112)
MCU_GPIO113: U15.N4(GPIO113)
MCU_GPIO114: U15.N3(GPIO114)
MCU_GPIO115: U15.V12(GPIO115)
MCU_GPIO116: U15.W10(GPIO116)
MCU_GPIO117: U15.U12(GPIO117)
MCU_GPIO118: U15.T12(GPIO118)
MCU_GPIO119: U15.T15(GPIO119)
MCU_GPIO120: U15.U15(GPIO120)
MCU_GPIO121: U15.W16(GPIO121)
MCU_GPIO122: U15.T8(GPIO122)
MCU_GPIO123: U15.U8(GPIO123)
MCU_GPIO124: U15.V8(GPIO124)
MCU_GPIO125: U15.T9(GPIO125)
MCU_GPIO126: U15.U9(GPIO126)
MCU_GPIO127: U15.V9(GPIO127)
MCU_GPIO128: U15.W9(GPIO128)
MCU_GPIO129: U15.T10(GPIO129)
MCU_GPIO130: U15.U10(GPIO130)
MCU_GPIO131: U15.V10(GPIO131)
MCU_GPIO132: U15.W18(GPIO132)
MCU_GPIO133: U15.G18(GPIO133)
MCU_GPIO134: U15.V18(GPIO134)
MCU_GPIO135: U15.U18(GPIO135)
MCU_GPIO136: U15.T17(GPIO136)
MCU_GPIO137: U15.T18(GPIO137)
MCU_GPIO138: U15.T19(GPIO138)
MCU_GPIO139: U15.N19(GPIO139)
MCU_GPIO140: U15.M19(GPIO140)
MCU_GPIO141: U15.M18(GPIO141)
MCU_GPIO142: U15.L19(GPIO142)
MCU_GPIO143: U15.F18(GPIO143)
MCU_GPIO144: U15.F17(GPIO144)
MCU_GPIO145: U15.E17(GPIO145)
MCU_GPIO146: U15.D18(GPIO146)
MCU_GPIO147: U15.D17(GPIO147)
MCU_GPIO148: U15.D14(GPIO148)
MCU_GPIO149: U15.A13(GPIO149)
MCU_GPIO150: U15.B13(GPIO150)
MCU_GPIO151: U15.C13(GPIO151)
MCU_GPIO152: U15.D13(GPIO152)
MCU_GPIO153: U15.A12(GPIO153)
MCU_GPIO154: U15.B12(GPIO154)
MCU_GPIO155: U15.C12(GPIO155)
MCU_GPIO156: U15.D12(GPIO156)
MCU_GPIO157: U15.B10(GPIO157)
MCU_GPIO158: U15.C10(GPIO158)
MCU_GPIO159: U15.D10(GPIO159)
MCU_GPIO160: U15.B9(GPIO160)
MCU_GPIO161: U15.C9(GPIO161)
MCU_GPIO162: U15.D9(GPIO162)
MCU_GPIO163: U15.A8(GPIO163)
MCU_GPIO164: U15.B8(GPIO164)
MCU_GPIO165: U15.C5(GPIO165)
MCU_GPIO166: U15.D5(GPIO166)
MCU_GPIO167: U15.C4(GPIO167)
MCU_GPIO168: U15.D4(GPIO168)
NetR218_2: R218.2 U15.M16(GPIO59)
NetR219_2: R219.2 U15.L16(GPIO61)
NetR220_2: R220.2 U15.L17(GPIO64)
NetR221_2: R221.2 U15.K17(GPIO66)
NetR222_2: R222.2 U15.A17(GPIO70)
NetR223_2: R223.2 U15.B16(GPIO72)

### Notes on the sheet
- Drawn By:
- SVN Rev:
- Number:
- TID #:
- Orderable:
- Rev:
- Sheet Title:
- File:
- Project Title:
- Designed for:
- Assembly Variant:
- Mod. Date:
- Sheet:
- Size:
- of
- B
- http://www.ti.com
- Texas Instruments and/or its licensors do not warrant the accuracy or completeness of this specification or any information contained therein. Texas Instruments and/or its licensors do not warrant that this design will meet the specifications, will be suitable for your application or fit for any particular purpose, or will operate in an implementation. Texas Instruments and/or its licensors do not warrant that the design is production worthy. You should completely validate and test your design implementation to confirm the system functionality for your application.
- Engineer:
- Contact:
- © Texas Instruments

### Library data of the parts
R218-R223 = CMP-0026916-3: as R174 on sheet OMODRI_Support; Supplier Part Number 2: 89M6649; Supplier 2: Newark; Supplier Part Number 3: 71-CRCW0402J-39-E3; Supplier 3: Mouser; RoHS: E; Value1: 5%; MountType: SMT; Supplier 1: Digi-Key; PackageReference: 0402; Tolerance_%: 5%; Res_ohm: 39; SizeArea_mm2: 0.5; CompType: Resistor; PartNumber: CRCW040239R0JNED; ComponentLink1Description: Datasheet link; Supplier Part Number 1: 541-39JCT-ND; Technology: Thick Film; ComponentLink1URL: http://www.vishay.com/docs/20035/dcrcwe3.pdf
U15 = CMP-0081777-3: as U15 on sheet OMODRI_Support; ComponentLink1Description: Datasheet Link; ComponentLink2Description: Product Folder; PackageReference: ZWT0337A; PartNumber: TMS320F28388DZWTS; PackageDescription: NFBGA-337; ComponentLink2URL: http://www.ti.com/product/tms320f28388d; Alternate Manufacturer: Texas Instruments; ComponentLink3URL: http://www.ti.com/product/tms320f28388d/datasheet; ComponentLink1URL: http://www.ti.com/lit/ds/symlink/tms320f28388d.pdf; MountType: SMT; ComponentLink3Description: Online Datasheet; SizeX_mm: 16

## Nets that join several sheets
24V: OMODRI_Gate_Driver_1 (C86.2 C127.2 TP16.1 U2.3), OMODRI_Gate_Driver_2 (C87.2 C133.2 TP19.1 U3.3), OMODRI_Power (C89.2 C172.2 L1.1)
AbsEnc1-5V: OMODRI_BiSSEnc (C29.2 J8.6 U7.A1), OMODRI_EnDATEnc (C42.2 J14.6 U13.A1)
AbsEnc2-5V: OMODRI_BiSSEnc (C32.2 J7.6 U11.A1), OMODRI_EnDATEnc (C63.2 J15.6 U21.A1)
GND: OMODRI_Gate_Driver_1 (41 pins), OMODRI_Gate_Driver_2 (35 pins), OMODRI_QuadEnc (12 pins), OMODRI_BiSSEnc (22 pins), OMODRI_EnDATEnc (30 pins), OMODRI_EtherCAT_0 (33 pins), OMODRI_EtherCAT_1 (26 pins), OMODRI_Power (109 pins), OMODRI_Support (15 pins)
VDD_3V3: OMODRI_Gate_Driver_1 (D1.2 R25.1 R97.2), OMODRI_Gate_Driver_2 (D3.2 R99.2), OMODRI_QuadEnc (C131.2 R91.2 U20.2), OMODRI_BiSSEnc (8 pins), OMODRI_EnDATEnc (18 pins), OMODRI_EtherCAT_0 (18 pins), OMODRI_EtherCAT_1 (15 pins), OMODRI_Power (51 pins), OMODRI_Support (9 pins)
VDD_5V: OMODRI_QuadEnc (6 pins), OMODRI_BiSSEnc (C1.2 C24.2 U7.A2 U11.A2), OMODRI_EnDATEnc (C40.2 C41.2 U13.A2 U21.A2)
VM: OMODRI_Gate_Driver_1 (22 pins), OMODRI_Gate_Driver_2 (19 pins)
VREF1: OMODRI_Gate_Driver_1 (C130.2 U2.24), OMODRI_Gate_Driver_2 (C137.2 U3.24)
DRV_SCLK: OMODRI_Gate_Driver_1 (J1.14 U2.29), OMODRI_Gate_Driver_2 (J12.14 U3.29)
DRV_SDI: OMODRI_Gate_Driver_1 (J2.11 U2.28), OMODRI_Gate_Driver_2 (J13.11 U3.28)
DRV_SDO: OMODRI_Gate_Driver_1 (J2.13 R25.2 U2.27), OMODRI_Gate_Driver_2 (J13.13 U3.27)
Enc1_PWREN: OMODRI_BiSSEnc (U7.B2), OMODRI_EnDATEnc (U13.B2)
Enc2_PWREN: OMODRI_BiSSEnc (U11.B2), OMODRI_EnDATEnc (U21.B2)
MCU_XRSn: OMODRI_Power (R46.1 U31.3), OMODRI_Support (C126.2 R47.1 S1.1 U15.F19)
NetC38_2: OMODRI_BiSSEnc (C38.2 R26.2 U4.3), OMODRI_EnDATEnc (R42.1 U9.4)
NetC68_2: OMODRI_BiSSEnc (C68.2 R30.2 U16.3), OMODRI_EnDATEnc (R63.1 U12.4)
NetR22_1: OMODRI_BiSSEnc (R22.1), OMODRI_EnDATEnc (R34.1)
NetR33_1: OMODRI_BiSSEnc (R33.1), OMODRI_EnDATEnc (R35.1)